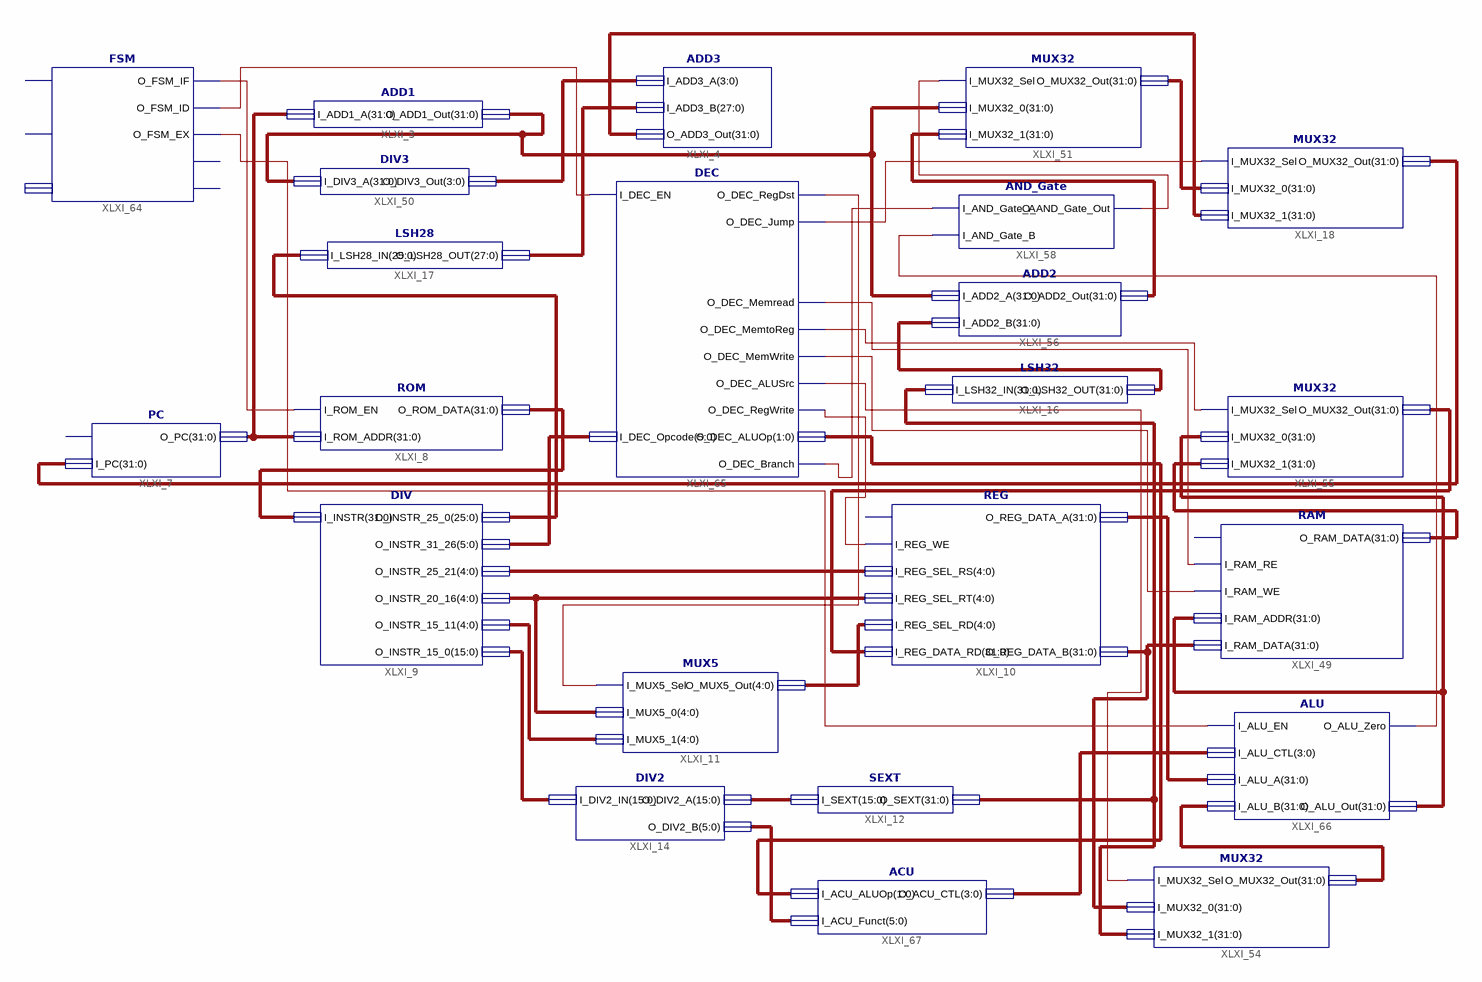
[diagram p0: schematic sheet 1]
// Xilinx ISE schematic CCSiMP32.sch (artix7) as structural Verilog: 23 symbols, 0 ports
module CCSiMP32 (
);

  wire XLXN_12, XLXN_91, XLXN_98, XLXN_103, XLXN_104, XLXN_105, XLXN_106, XLXN_113, XLXN_115, XLXN_116,
       XLXN_119, XLXN_120, XLXN_125;
  wire [1:0] XLXN_94;
  wire [3:0] XLXN_57, XLXN_95;
  wire [4:0] XLXN_3, XLXN_4, XLXN_6, XLXN_7;
  wire [5:0] XLXN_20, XLXN_112;
  wire [15:0] XLXN_18, XLXN_19;
  wire [25:0] XLXN_52;
  wire [27:0] XLXN_53;
  wire [31:0] XLXN_1, XLXN_2, XLXN_56, XLXN_59, XLXN_60, XLXN_90, XLXN_92, XLXN_93, XLXN_96, XLXN_97,
       XLXN_99, XLXN_100, XLXN_101, XLXN_107, XLXN_109;

  LSH28 XLXI_17 (.I_LSH28_IN(XLXN_52), .O_LSH28_OUT(XLXN_53));
  PC XLXI_7 (.I_PC(XLXN_93), .O_PC(XLXN_1));  // open: I_PC_UPDATE
  ADD1 XLXI_3 (.I_ADD1_A(XLXN_1), .O_ADD1_Out(XLXN_56));
  ROM XLXI_8 (.I_ROM_EN(XLXN_119), .I_ROM_ADDR(XLXN_1), .O_ROM_DATA(XLXN_2));
  DIV XLXI_9 (
    .I_INSTR(XLXN_2), .O_INSTR_25_0(XLXN_52), .O_INSTR_31_26(XLXN_112), .O_INSTR_25_21(XLXN_3),
    .O_INSTR_20_16(XLXN_4), .O_INSTR_15_11(XLXN_6), .O_INSTR_15_0(XLXN_18));
  REG XLXI_10 (
    .I_REG_WE(XLXN_113), .I_REG_SEL_RS(XLXN_3), .I_REG_SEL_RT(XLXN_4), .I_REG_SEL_RD(XLXN_7),
    .I_REG_DATA_RD(XLXN_109), .O_REG_DATA_A(XLXN_100), .O_REG_DATA_B(XLXN_96));  // open: I_REG_EN
  MUX5 XLXI_11 (.I_MUX5_Sel(XLXN_12), .I_MUX5_0(XLXN_4), .I_MUX5_1(XLXN_6), .O_MUX5_Out(XLXN_7));
  DIV2 XLXI_14 (.I_DIV2_IN(XLXN_18), .O_DIV2_A(XLXN_19), .O_DIV2_B(XLXN_20));
  SEXT XLXI_12 (.I_SEXT(XLXN_19), .O_SEXT(XLXN_97));
  ADD3 XLXI_4 (.I_ADD3_A(XLXN_57), .I_ADD3_B(XLXN_53), .O_ADD3_Out(XLXN_92));
  MUX32 XLXI_18 (.I_MUX32_Sel(XLXN_105), .I_MUX32_0(XLXN_90), .I_MUX32_1(XLXN_92), .O_MUX32_Out(XLXN_93));
  RAM XLXI_49 (
    .I_RAM_RE(XLXN_103), .I_RAM_WE(XLXN_104), .I_RAM_ADDR(XLXN_101), .I_RAM_DATA(XLXN_96),
    .O_RAM_DATA(XLXN_107));  // open: I_RAM_EN
  DIV3 XLXI_50 (.I_DIV3_A(XLXN_56), .O_DIV3_Out(XLXN_57));
  MUX32 XLXI_51 (.I_MUX32_Sel(XLXN_91), .I_MUX32_0(XLXN_56), .I_MUX32_1(XLXN_60), .O_MUX32_Out(XLXN_90));
  MUX32 XLXI_54 (.I_MUX32_Sel(XLXN_98), .I_MUX32_0(XLXN_96), .I_MUX32_1(XLXN_97), .O_MUX32_Out(XLXN_99));
  MUX32 XLXI_55 (.I_MUX32_Sel(XLXN_106), .I_MUX32_0(XLXN_101), .I_MUX32_1(XLXN_107), .O_MUX32_Out(XLXN_109));
  AND_Gate XLXI_58 (.I_AND_Gate_A(XLXN_115), .I_AND_Gate_B(XLXN_116), .O_AND_Gate_Out(XLXN_91));
  LSH32 XLXI_16 (.I_LSH32_IN(XLXN_97), .O_LSH32_OUT(XLXN_59));
  ADD2 XLXI_56 (.I_ADD2_A(XLXN_56), .I_ADD2_B(XLXN_59), .O_ADD2_Out(XLXN_60));
  FSM XLXI_64 (
    .O_FSM_IF(XLXN_119), .O_FSM_ID(XLXN_120), .O_FSM_EX(XLXN_125));  // open: I_FSM_CLK, I_FSM_EN, I_FSM_INST, O_FSM_ME, O_FSM_WB
  DEC XLXI_65 (
    .I_DEC_EN(XLXN_120), .I_DEC_Opcode(XLXN_112), .O_DEC_RegDst(XLXN_12), .O_DEC_Jump(XLXN_105),
    .O_DEC_Branch(XLXN_115), .O_DEC_Memread(XLXN_103), .O_DEC_MemtoReg(XLXN_106), .O_DEC_MemWrite(XLXN_104),
    .O_DEC_ALUSrc(XLXN_98), .O_DEC_RegWrite(XLXN_113), .O_DEC_ALUOp(XLXN_94));
  ALU XLXI_66 (
    .I_ALU_EN(XLXN_125), .I_ALU_CTL(XLXN_95), .I_ALU_A(XLXN_100), .I_ALU_B(XLXN_99), .O_ALU_Zero(XLXN_116),
    .O_ALU_Out(XLXN_101));
  ACU XLXI_67 (.I_ACU_ALUOp(XLXN_94), .I_ACU_Funct(XLXN_20), .O_ACU_CTL(XLXN_95));
endmodule
